# EAGLE schematic AlarisHandV1 (EAGLE 9.6.2)
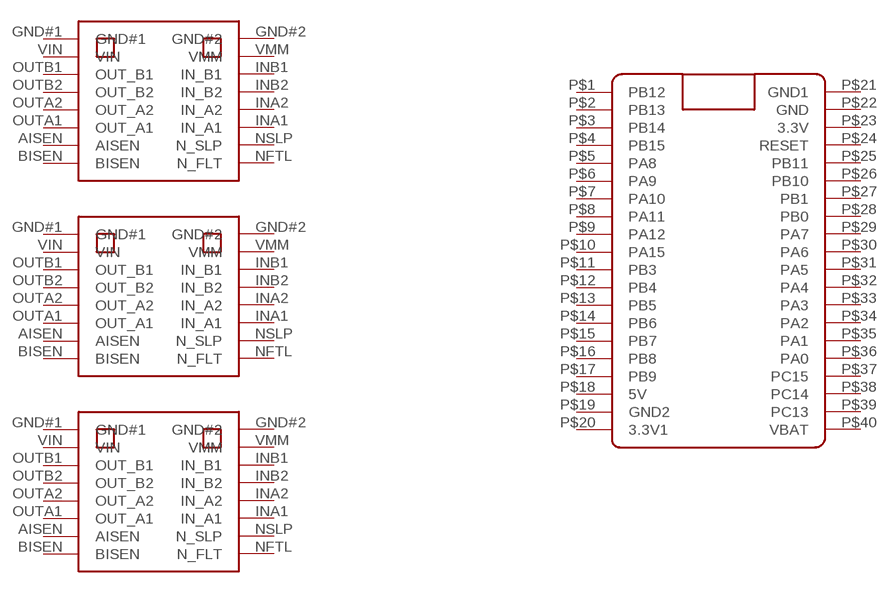
[diagram p0: schematic, sheet 1]

## Parts
U$1  POLOLUDRV8833  [POLOLUDRV8833]
U$2  POLOLUDRV8833  [POLOLUDRV8833]
U$3  POLOLUDRV8833  [POLOLUDRV8833]
U$4  BLUE_PILL  [BLUE_PILL]
Unconnected: U$1.AISEN U$1.BISEN U$1.GND#1 U$1.GND#2 U$1.INA1(IN_A1) U$1.INA2(IN_A2) U$1.INB1(IN_B1) U$1.INB2(IN_B2) U$1.NFTL(N_FLT) U$1.NSLP(N_SLP) U$1.OUTA1(OUT_A1) U$1.OUTA2(OUT_A2) U$1.OUTB1(OUT_B1) U$1.OUTB2(OUT_B2) U$1.VIN U$1.VMM U$2.AISEN U$2.BISEN U$2.GND#1 U$2.GND#2 U$2.INA1(IN_A1) U$2.INA2(IN_A2) U$2.INB1(IN_B1) U$2.INB2(IN_B2) U$2.NFTL(N_FLT) U$2.NSLP(N_SLP) U$2.OUTA1(OUT_A1) U$2.OUTA2(OUT_A2) U$2.OUTB1(OUT_B1) U$2.OUTB2(OUT_B2) U$2.VIN U$2.VMM U$3.AISEN U$3.BISEN U$3.GND#1 U$3.GND#2 U$3.INA1(IN_A1) U$3.INA2(IN_A2) U$3.INB1(IN_B1) U$3.INB2(IN_B2) U$3.NFTL(N_FLT) U$3.NSLP(N_SLP) U$3.OUTA1(OUT_A1) U$3.OUTA2(OUT_A2) U$3.OUTB1(OUT_B1) U$3.OUTB2(OUT_B2) U$3.VIN U$3.VMM U$4.P$1(PB12) U$4.P$2(PB13) U$4.P$3(PB14) U$4.P$4(PB15) U$4.P$5(PA8) U$4.P$6(PA9) U$4.P$7(PA10) U$4.P$8(PA11) U$4.P$9(PA12) U$4.P$10(PA15) U$4.P$11(PB3) U$4.P$12(PB4) U$4.P$13(PB5) U$4.P$14(PB6) U$4.P$15(PB7) U$4.P$16(PB8) U$4.P$17(PB9) U$4.P$18(5V) U$4.P$19(GND2) U$4.P$20(3.3V1) U$4.P$22(GND) U$4.P$23(3.3V) U$4.P$24(RESET) U$4.P$25(PB11) U$4.P$26(PB10) U$4.P$27(PB1) U$4.P$28(PB0) U$4.P$29(PA7) U$4.P$30(PA6) U$4.P$31(PA5) U$4.P$32(PA4) U$4.P$33(PA3) U$4.P$34(PA2) U$4.P$35(PA1) U$4.P$36(PA0) U$4.P$37(PC15) U$4.P$38(PC14) U$4.P$39(PC13) U$4.P$40(VBAT)

## Power pins joined to a net without a drawn wire
GND1: U$4.P$21(GND1)

## Library data of the parts
U$1-U$3 = AlarisHandLib:POLOLUDRV8833
U$4 = BluePill:BLUE_PILL